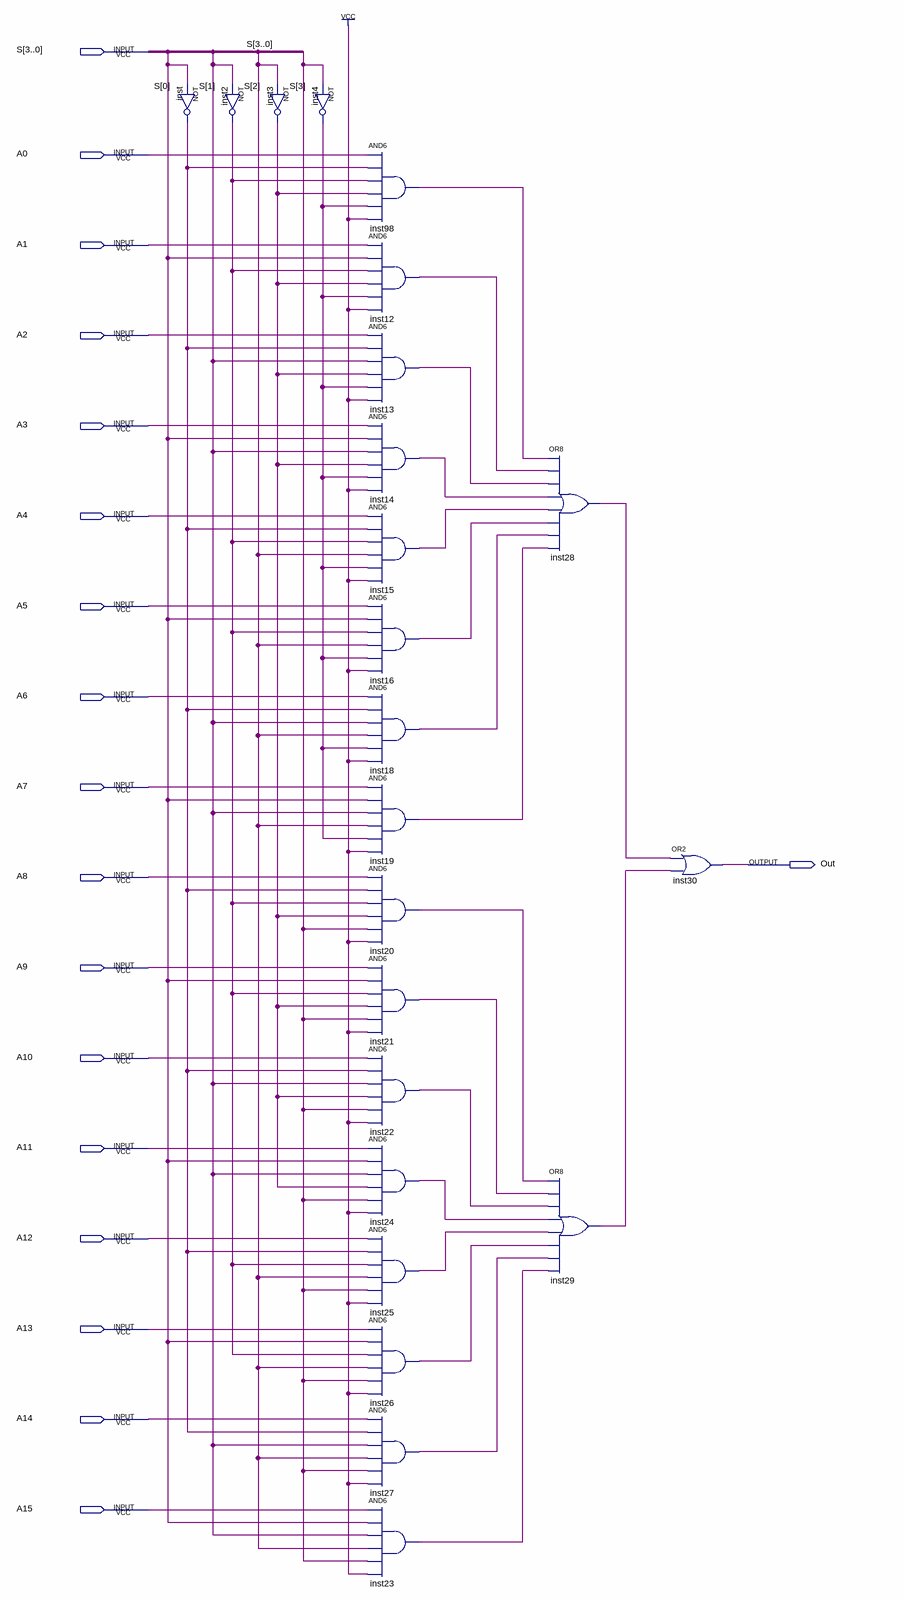
[diagram p0: schematic sheet]
// Quartus schematic selector16.bdf as structural Verilog: 23 symbols, 18 pins
module selector16 (
  input  [3:0] S,
  input  A0,
  input  A1,
  input  A2,
  input  A3,
  input  A4,
  input  A5,
  input  A6,
  input  A7,
  input  A8,
  input  A9,
  input  A10,
  input  A11,
  input  A12,
  input  A13,
  input  A14,
  input  A15,
  output Out
);

  wire inst2_out, inst3_out, inst4_out, inst12_out, inst13_out, inst14_out, inst15_out, inst16_out,
       inst18_out, inst19_out, inst20_out, inst21_out, inst22_out, inst23_out, inst24_out, inst25_out,
       inst26_out, inst27_out, inst28_out, inst29_out, inst98_out, inst_out;

  not inst (inst_out, S[0]);
  not inst2 (inst2_out, S[1]);
  not inst3 (inst3_out, S[2]);
  not inst4 (inst4_out, S[3]);
  and inst98 (inst98_out, A0, inst_out, inst2_out, inst3_out, inst4_out, 1'b1);
  and inst12 (inst12_out, A1, S[0], inst2_out, inst3_out, inst4_out, 1'b1);
  and inst13 (inst13_out, A2, inst_out, S[1], inst3_out, inst4_out, 1'b1);
  and inst14 (inst14_out, A3, S[0], S[1], inst3_out, inst4_out, 1'b1);
  and inst15 (inst15_out, A4, inst_out, inst2_out, S[2], inst4_out, 1'b1);
  and inst16 (inst16_out, A5, S[0], inst2_out, S[2], inst4_out, 1'b1);
  and inst18 (inst18_out, A6, inst_out, S[1], S[2], inst4_out, 1'b1);
  and inst19 (inst19_out, A7, S[0], S[1], S[2], inst4_out, 1'b1);
  and inst20 (inst20_out, A8, inst_out, inst2_out, inst3_out, S[3], 1'b1);
  and inst21 (inst21_out, A9, S[0], inst2_out, inst3_out, S[3], 1'b1);
  and inst22 (inst22_out, A10, inst_out, S[1], inst3_out, S[3], 1'b1);
  and inst24 (inst24_out, A11, S[0], S[1], inst3_out, S[3], 1'b1);
  and inst25 (inst25_out, A12, inst_out, inst2_out, S[2], S[3], 1'b1);
  and inst26 (inst26_out, A13, S[0], inst2_out, S[2], S[3], 1'b1);
  and inst27 (inst27_out, A14, inst_out, S[1], S[2], S[3], 1'b1);
  and inst23 (inst23_out, A15, S[0], S[1], S[2], S[3], 1'b1);
  or inst28 (inst28_out, inst98_out, inst12_out, inst13_out, inst14_out, inst15_out, inst16_out, inst18_out, inst19_out);
  or inst29 (inst29_out, inst20_out, inst21_out, inst22_out, inst24_out, inst25_out, inst26_out, inst27_out, inst23_out);
  or inst30 (Out, inst28_out, inst29_out);
endmodule
